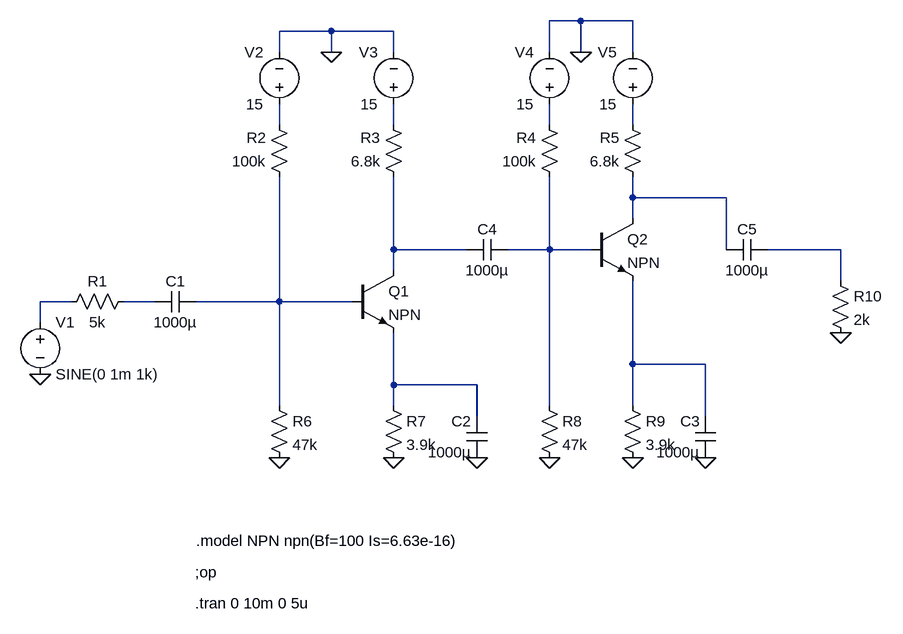
[diagram p0: schematic Draft2.asc]
Draft2.asc, the LTspice schematic file:
Version 4
SHEET 1 1508 680
WIRE 928 -288 880 -288
WIRE 1008 -288 928 -288
WIRE 544 -272 464 -272
WIRE 640 -272 544 -272
WIRE 464 -240 464 -272
WIRE 544 -240 544 -272
WIRE 640 -240 640 -272
WIRE 880 -240 880 -288
WIRE 928 -240 928 -288
WIRE 1008 -240 1008 -288
WIRE 464 -128 464 -160
WIRE 640 -128 640 -160
WIRE 880 -128 880 -160
WIRE 1008 -128 1008 -160
WIRE 1008 -16 1008 -48
WIRE 1152 -16 1008 -16
WIRE 1008 16 1008 -16
WIRE 640 64 640 -48
WIRE 752 64 640 64
WIRE 880 64 880 -48
WIRE 880 64 816 64
WIRE 944 64 880 64
WIRE 1152 64 1152 -16
WIRE 1328 64 1216 64
WIRE 640 96 640 64
WIRE 1328 112 1328 64
WIRE 144 144 96 144
WIRE 272 144 224 144
WIRE 464 144 464 -48
WIRE 464 144 336 144
WIRE 576 144 464 144
WIRE 96 176 96 144
WIRE 1008 240 1008 112
WIRE 1120 240 1008 240
WIRE 640 272 640 192
WIRE 768 272 640 272
WIRE 464 304 464 144
WIRE 640 304 640 272
WIRE 880 304 880 64
WIRE 1008 304 1008 240
WIRE 768 320 768 272
WIRE 1120 320 1120 240
FLAG 96 256 0
FLAG 464 384 0
FLAG 640 384 0
FLAG 768 384 0
FLAG 880 384 0
FLAG 1008 384 0
FLAG 1120 384 0
FLAG 1328 192 0
FLAG 544 -240 0
FLAG 928 -240 0
SYMBOL voltage 96 160 R0
WINDOW 123 0 0 Left 0
WINDOW 39 0 0 Left 0
SYMATTR InstName V1
SYMATTR Value SINE(0 1m 1k)
SYMBOL voltage 464 -144 R180
WINDOW 0 24 96 Left 2
WINDOW 3 24 16 Left 2
WINDOW 123 0 0 Left 0
WINDOW 39 0 0 Left 0
SYMATTR InstName V2
SYMATTR Value 15
SYMBOL voltage 640 -144 R180
WINDOW 0 24 96 Left 2
WINDOW 3 24 16 Left 2
WINDOW 123 0 0 Left 0
WINDOW 39 0 0 Left 0
SYMATTR InstName V3
SYMATTR Value 15
SYMBOL voltage 880 -144 R180
WINDOW 0 24 96 Left 2
WINDOW 3 24 16 Left 2
WINDOW 123 0 0 Left 0
WINDOW 39 0 0 Left 0
SYMATTR InstName V4
SYMATTR Value 15
SYMBOL voltage 1008 -144 R180
WINDOW 0 24 96 Left 2
WINDOW 3 24 16 Left 2
WINDOW 123 0 0 Left 0
WINDOW 39 0 0 Left 0
SYMATTR InstName V5
SYMATTR Value 15
SYMBOL res 240 128 R90
WINDOW 0 0 56 VBottom 2
WINDOW 3 32 56 VTop 2
SYMATTR InstName R1
SYMATTR Value 5k
SYMBOL res 480 -32 R180
WINDOW 0 36 76 Left 2
WINDOW 3 36 40 Left 2
SYMATTR InstName R2
SYMATTR Value 100k
SYMBOL res 656 -32 R180
WINDOW 0 36 76 Left 2
WINDOW 3 36 40 Left 2
SYMATTR InstName R3
SYMATTR Value 6.8k
SYMBOL res 896 -32 R180
WINDOW 0 36 76 Left 2
WINDOW 3 36 40 Left 2
SYMATTR InstName R4
SYMATTR Value 100k
SYMBOL res 1024 -32 R180
WINDOW 0 36 76 Left 2
WINDOW 3 36 40 Left 2
SYMATTR InstName R5
SYMATTR Value 6.8k
SYMBOL res 448 288 R0
SYMATTR InstName R6
SYMATTR Value 47k
SYMBOL res 624 288 R0
SYMATTR InstName R7
SYMATTR Value 3.9k
SYMBOL res 864 288 R0
SYMATTR InstName R8
SYMATTR Value 47k
SYMBOL res 992 288 R0
SYMATTR InstName R9
SYMATTR Value 3.9k
SYMBOL res 1312 96 R0
SYMATTR InstName R10
SYMATTR Value 2k
SYMBOL cap 336 128 R90
WINDOW 0 0 32 VBottom 2
WINDOW 3 32 32 VTop 2
SYMATTR InstName C1
SYMATTR Value 1000µ
SYMBOL cap 784 384 R180
WINDOW 0 24 56 Left 2
WINDOW 3 24 8 Left 2
SYMATTR InstName C2
SYMATTR Value 1000µ
SYMBOL cap 1136 384 R180
WINDOW 0 24 56 Left 2
WINDOW 3 24 8 Left 2
SYMATTR InstName C3
SYMATTR Value 1000µ
SYMBOL cap 752 80 R270
WINDOW 0 32 32 VTop 2
WINDOW 3 0 32 VBottom 2
SYMATTR InstName C4
SYMATTR Value 1000µ
SYMBOL cap 1216 48 R90
WINDOW 0 0 32 VBottom 2
WINDOW 3 32 32 VTop 2
SYMATTR InstName C5
SYMATTR Value 1000µ
SYMBOL npn 576 96 R0
SYMATTR InstName Q1
SYMBOL npn 944 16 R0
SYMATTR InstName Q2
TEXT 336 512 Left 2 !.model NPN npn(Bf=100 Is=6.63e-16)
TEXT 334 560 Left 2 !;op
TEXT 334 608 Left 2 !.tran 0 10m 0 5u

The netlist it stands for:
* Draft2.asc
V1 N009 0 SINE(0 1m 1k)
V2 N001 0 15
V3 N002 0 15
V4 N003 0 15
V5 N004 0 15
R1 N010 N009 5k
R2 N011 N001 100k
R3 N006 N002 6.8k
R4 N007 N003 100k
R5 N005 N004 6.8k
R6 N011 0 47k
R7 N013 0 3.9k
R8 N007 0 47k
R9 N012 0 3.9k
R10 N008 0 2k
C1 N011 N010 1000µ
C2 0 N013 1000µ
C3 0 N012 1000µ
C4 N006 N007 1000µ
C5 N008 N005 1000µ
Q1 N006 N011 N013 0 NPN
Q2 N005 N007 N012 0 NPN
.model NPN NPN
.model PNP PNP
.lib standard.bjt
.model NPN npn(Bf=100 Is=6.63e-16)
;op
.tran 0 10m 0 5u
.backanno
.end